# Altium project Beam Break - Foraging Feeder Fix.PrjPcb
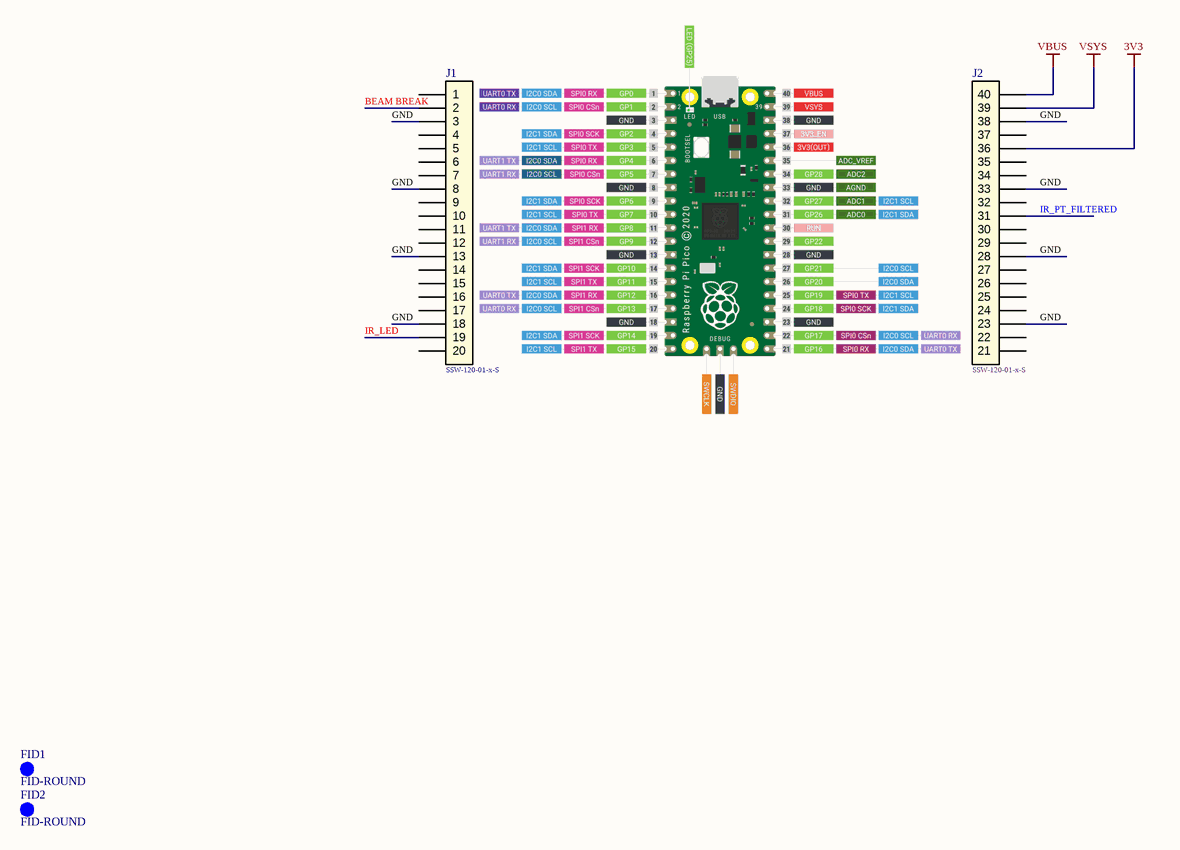
[diagram p0: PicoModuleInterface.SchDoc]
Project: Beam Break Fix - Foraging Feeder
2 sheets, 15 parts. Net scope: global (net labels, ports and power ports of the same name join across sheets).
Board file: BeamBreakFix.PcbDoc
Sheets:
  PicoModuleInterface.SchDoc
  BeamBreakFix.SchDoc

## Sheet PicoModuleInterface.SchDoc
size 297 x 209 mm; SheetNumber: 1; SheetTotal: 2; swcgroup: FabLab; Org: Sainsbury Wellcome Centre; Add1: 25 Howland Street; Add2: London; Add3: W1T 4JG; WebAddress: www.sainsburywellcome.org; SheetSize: A4; SheetName: Pico Module Interface

### Parts
FID1  FID-ROUND  [Fid_Round]  (no BOM)
FID2  FID-ROUND  [Fid_Round]  (no BOM)
J1  SSW-120-01-x-S  [SAMTEC_SSW-120-01-G-S]
J2  SSW-120-01-x-S - 21-40  [SAMTEC_SSW-120-01-G-S - 21-40]  (value not drawn)

### Nets
3V3: J2.36
GND: J1.3 J1.8 J1.13 J1.18 J2.23 J2.28 J2.33 J2.38
VBUS: J2.40
VSYS: J2.39
BEAM BREAK: J1.2
IR_LED: J1.19
IR_PT_FILTERED: J2.31

Not connected (* = marked no-connect by the designer): J1 1 4 5 6 7 9 10 11 12 14 15 16 17 20; J2 21 22 24 25 26 27 29 30 32 34 35 37

### Notes on the sheet
- (near J2) SSW-120-01-x-S
- FILE
- VARIANT
- DATE
- REVISION
- SHEET
- /
- PROJECT
- SIZE

### Library data of the parts
FID1 FID2 = CMP-C00-0001-2: Round Fiducial
J1 = CMP-310-0034-3: Conn Socket Strip SKT 20 POS 2.54mm Solder ST Thru-Hole; Gender: Female; Number of Contacts: 20; Mating Cycles: 100; Number of Rows: 1; Color: Black; RoHS Compliant: Yes; Contact Plating: Gold; Pitch: 2.54mm; Termination: Solder; Contact Material: Bronze; Mount: Through Hole
J2 = CMP-310-0035-2: Conn Socket Strip SKT 20 POS 2.54mm Solder ST Thru-Hole (pins 21 - 40); Gender: Female; Mating Cycles: 100; Number of Contacts: 20; Contact Material: Bronze; RoHS Compliant: Yes; Number of Rows: 1; Contact Plating: Gold; Mount: Through Hole; Pitch: 2.54mm; Termination: Solder; Color: Black

## Sheet BeamBreakFix.SchDoc
size 297 x 209 mm; Revision: 1; SheetNumber: 2; SheetTotal: 2; swcgroup: FabLab; Org: Sainsbury Wellcome Centre; Add1: 25 Howland Street; Add2: London; Add3: W1T 4JG; WebAddress: www.sainsburywellcome.org; SheetSize: A4; SheetName: Beam Break Fix
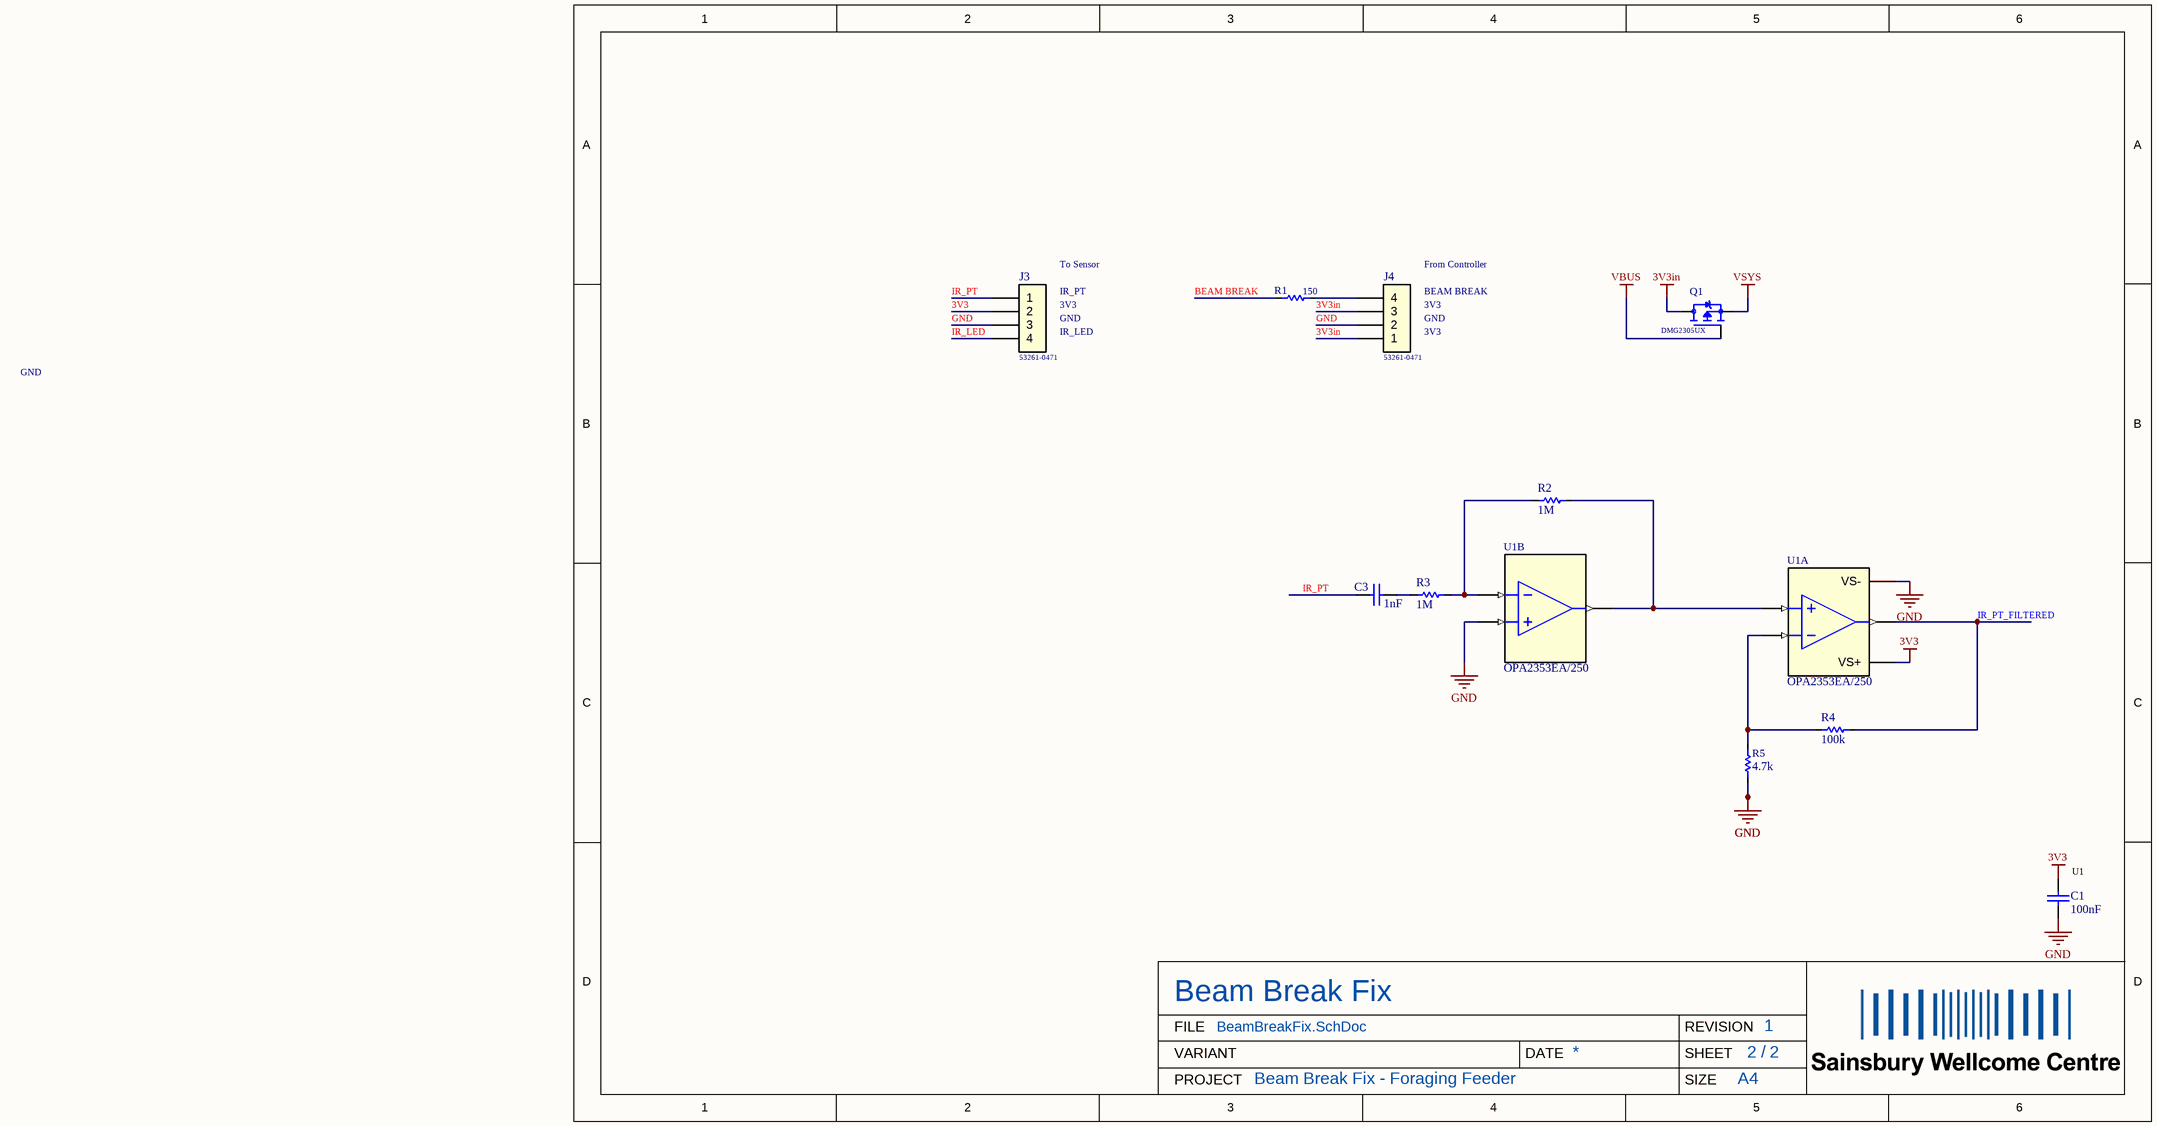
[diagram p1: BeamBreakFix.SchDoc]

### Parts
C1  value 100nF  [FP-GRM188-0_1-e0_2_0_5-IPC_B]  (hidden comment: C0603-100nF-100V-10%-X7R)
C3  value 1nF  [FP-0603-L_1_6_0_15-W_0_81-IPC_C]  (hidden comment: C0603-1nF-50V-1%-C0G)
J3  53261-0471  [MOLEX_53261-0471]
J4  53261-0471  [MOLEX_53261-0471]
Q1  PartNumber: DMG2305UX  [FP-SOT23-IPC_B]  (hidden comment: DMG2305UX-7)
R1  value 150  [FP-CPF0603-IPC_B]  (hidden comment: R0603-150R-1/16W-0.1%)
R2  value 1M  [FP-CPF0603-IPC_B]  (hidden comment: R0603-1M-1/16W-0.1%)
R3  value 1M  [FP-CPF0603-IPC_B]  (hidden comment: R0603-1M-1/16W-0.1%)
R4  value 100k  [FP-CPF0603-IPC_B]  (hidden comment: R0603-100k-1/16W-0.1%)
R5  value 4.7k  [FP-CPF0603-IPC_B]  (hidden comment: R0603-4k7-1/16W-0.1%)
U1  OPA2353EA/250  [DGK0008A_N]  (parts A,B of 2)

### Nets
3V3: C1.2 J3.2 U1.8(VS+)
3V3in: J4.1 J4.3 Q1.3(DRAIN)
GND: C1.1 J3.3 J4.2 R5.1 U1.4(VS-) U1.5(IN+)
VBUS: Q1.1(GATE)
VSYS: Q1.2(SOURCE)
BEAM BREAK: R1.1
IR_LED: J3.4
IR_PT: C3.1 J3.1
IR_PT_FILTERED: R4.2 U1.1(OUT)
NetC3_2: C3.2 R3.1
NetJ4_4: J4.4 R1.2
NetR2_1: R2.1 R3.2 U1.6(IN-)
NetR2_2: R2.2 U1.3(IN+) U1.7(OUT)
NetR4_1: R4.1 R5.2 U1.2(IN-)

### Notes on the sheet
- (near J3) To Sensor
- (near J4) From Controller
- (near J3) IR_PT
- (near J3) 3V3
- (near J3) GND
- (near J3) IR_LED
- (near J4) BEAM BREAK
- (near J4) 3V3
- (near J4) GND
- GND
- (near C1) U1
- FILE
- VARIANT
- DATE
- REVISION
- SHEET
- /
- PROJECT
- SIZE

### Library data of the parts
C1 = CMP-611-0027-19: 0.1µF ±10% 100V Ceramic Capacitor X7R 0603 (1608 Metric); Pick&PlaceFootprint: 0603_CAP; Dielectric: X7R; REACH SVHC: No SVHC; Case Code (Metric): 1608; Series: GRM; Case/Package: 0603; Capacitance: 100nF; RoHS Compliant: Yes; Radiation Hardening: No; Case Code (Imperial): 0603; Min Operating Temperature: -55°C; Capacitor Type: Ceramic; Voltage Rating: 100V; Construction: Flat; Lead Free: Lead Free; Size: 0.8mm; Packaging: Tape and Reel; Voltage Rating (DC): 100V; Voltage: 100V; Width: 0.8mm; Max Operating Temperature: 125°C; RoHS: Yes; Material: Ceramic; Depth: 0.8mm; Thickness: 0.035inch; Termination: SMD/SMT; Weight: 0.000222oz; Length: 1.6mm; Mount: Surface Mount; Height: 0.8mm; Package Quantity: 1; Tolerance: 10%
C3 = CMP-611-0035-5: 0.001µF ±1% 50V Ceramic Capacitor C0G 0603 (1608 Metric); PartNumber: C0603-1nF-50V-5%-COG; Pick&PlaceFootprint: C0603; Capacitor Type: Ceramic; Tolerance: 1%; Voltage Rating: 50V; Mount: Surface Mount; RoHS: Yes; Case/Package: 0603_CAP; Dielectric: C0G
J3 J4 = CMP-370-0017-6: MOLEX 1.25mm (.049") Pitch PicoBlade Header, Surface Mount, Right Angle, Lead-free, 4 Circuits; Glow Wire Compliant: Non-compliant; Voltage Rating (DC): 125V; Number of Circuits: 4; Current Rating: 1A; Gender: Male; Insulation Resistance: 100MR; Contact Resistance: 20mR; Radiation Hardening: No; Color: Beige; Mount: Surface Mount; Contact Material: Tin; Packaging: Cut Tape; Pitch: 1.25mm; Termination: SMD/SMT; Lead Free: Lead Free; Number of Positions: 4; Number of Rows: 1; Orientation: Right Angle; Flammability Rating: UL94 V-0; Case/Package: 53261-0471; Series: 53261; REACH SVHC: Unknown; Number of Contacts: 4; Voltage Rating (AC): 125V; Housing Material: Thermoplastic; Contact Gender: Male; Contact Type: -; Lead Pitch: 1.25mm; Contact Plating: Tin; Max Operating Temperature: 105°C; Voltage Rating: 125V; Package Quantity: 1000; Min Operating Temperature: -40°C; Weight: 0.005598oz; Housing Color: Natural; Working Voltage: 125V
Q1 = CMP-830-0007-1: Power Field-Effect Transistor, 4.2A I(D), 20V, 0.052ohm, 1-Element, P-Channel, Silicon, Metal-oxide Semiconductor FET; Pick&PlaceFootprint: SOT-23-3; Mount: Surface Mount
R1 = CMP-633-0078-2: Surface Mount Resistor 150 Ohm 1/16 W 0.1% 0603 (1608 Metric); Voltage Rating: 50V; Max Power Dissipation: 62.5 mW; Power Rating: 62.5mW; Number of Resistors: 1; Temperature Coefficient: 25ppm/°C; Pick&PlaceFootprint: R0603; Size Code: 0603; Width: 0.8mm; Number of Pins: 2; Tolerance: 0.1%; Resistance: 150; Construction: Chip; Voltage Rating (DC): 50V; Resistor Type: FIXED RESISTOR; Number of Terminations: 2; Weight: 7.1E-05oz; Min Operating Temperature: -55°C; Length: 1.6mm; Case/Package: 0603; Packaging: Tape and Reel; REACH SVHC: Yes; Height: 0.45mm; Mount: Surface Mount; RoHS Compliant: Yes; ELV: Compliant; Case Code (Metric): 1608; Termination: Wraparound; RoHS: Yes; Case Code (Imperial): 0603; Max Operating Temperature: 155°C; Composition: Thin Film; Resistance Tolerance: 0.1%; Series: CPF; Technology: THIN FILM
R2 R3 = CMP-633-0066-9: Surface Mount Resistor 1M Ohm 1/16 W 0.1% 0603 (1608 Metric); Number of Resistors: 1; Power Rating: 62.5mW; Max Power Dissipation: 62.5 mW; Voltage Rating (DC): 50V; Pick&PlaceFootprint: R0603; Temperature Coefficient: 25ppm/°C; Resistance: 1M; Size Code: 0603; Width: 0.8mm; Case Code (Metric): 1608; Number of Terminations: 2; Max Operating Temperature: 155°C; Case Code (Imperial): 0603; Series: CPF; Packaging: Tape and Reel; RoHS: Yes; Resistor Type: Thin Film; Tolerance: 0.1%; Termination: Solder; Length: 1.6mm; Composition: Thin Film; Min Operating Temperature: -55°C; Resistance Tolerance: 0.1%; Voltage Rating: 50V; Technology: Thin Film; ELV: Compliant; Case/Package: 0603; Weight: 7.1E-05oz; REACH SVHC: No SVHC; RoHS Compliant: Yes; Height: 0.45mm; Mount: Surface Mount; Number of Pins: 2
R4 = CMP-633-0000-17: Surface Mount Resistor 100k Ohm 1/16 W 0.1% 0603 (1608 Metric); Pick&PlaceFootprint: R0603; Max Power Dissipation: 62.5 mW; Voltage Rating (DC): 50V; Number of Resistors: 1; Temperature Coefficient: 25ppm/°C; Power Rating: 62.5mW; Case Code (Imperial): 0603; Technology: Thin Film; Mount: Surface Mount; Case Code (Metric): 1608; Min Operating Temperature: -55°C; Series: CPF; RoHS Compliant: Yes; Voltage Rating: 50V; Number of Pins: 2; Height: 0.45mm; Composition: Thin Film; Width: 0.8mm; Max Operating Temperature: 155°C; Resistance: 100k; Case/Package: 0603; Termination: Solder; Packaging: Tape and Reel; Length: 1.6mm; RoHS: Yes; Weight: 7.1E-05oz; Size Code: 0603; Number of Terminations: 2; Resistor Type: Thin Film; Tolerance: 0.1%; ELV: Compliant; Resistance Tolerance: 0.1%; REACH SVHC: No SVHC
R5 = CMP-633-0024-17: Surface Mount Resistor 4.7k Ohm 1/16 W 0.1% 0603 (1608 Metric); Voltage Rating: 50V; Temperature Coefficient: 25ppm/°C; Number of Resistors: 1; Max Power Dissipation: 62.5 mW; Power Rating: 62.5mW; Pick&PlaceFootprint: R0603; Packaging: Tape and Reel; Weight: 7.1E-05oz; RoHS: Yes; REACH SVHC: No SVHC; Number of Pins: 2; Tolerance: 0.1%; Case Code (Imperial): 0603; Resistance Tolerance: 0.1%; Composition: Thin Film; Min Operating Temperature: -55°C; Case/Package: 0603; Case Code (Metric): 1608; Length: 1.6mm; Mount: Surface Mount; ELV: Compliant; RoHS Compliant: Yes; Height: 0.45mm; Resistor Type: Thin Film; Size Code: 0603; Number of Terminations: 2; Width: 0.8mm; Resistance: 4.7k; Max Operating Temperature: 155°C; Termination: Solder; Technology: Thin Film; Voltage Rating (DC): 50V; Series: CPF
U1 = CMP-941-0006-5: Operational Amplifier, 2 Func, 8000uV Offset-Max, CMOS, PDSO8; Pick&PlaceFootprint: TSSOP8; Package Equivalence Code: TSSOP8,.19; PartNumber: OPA2353EA/250

## Nets that join several sheets
3V3: PicoModuleInterface (J2.36), BeamBreakFix (C1.2 J3.2 U1.8)
GND: PicoModuleInterface (8 pins), BeamBreakFix (6 pins)
VBUS: PicoModuleInterface (J2.40), BeamBreakFix (Q1.1)
VSYS: PicoModuleInterface (J2.39), BeamBreakFix (Q1.2)
BEAM BREAK: PicoModuleInterface (J1.2), BeamBreakFix (R1.1)
IR_LED: PicoModuleInterface (J1.19), BeamBreakFix (J3.4)
IR_PT_FILTERED: PicoModuleInterface (J2.31), BeamBreakFix (R4.2 U1.1)